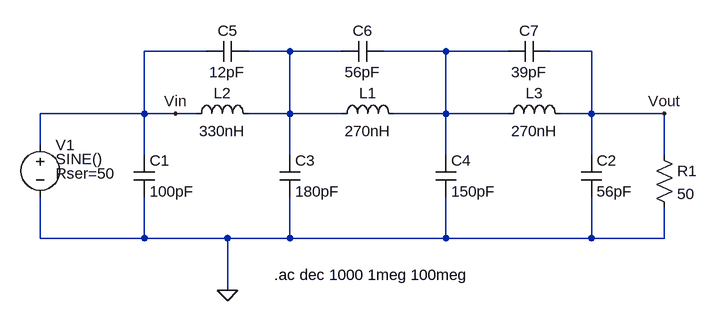
[diagram p0: schematic DXFT8Filter.asc]
DXFT8Filter.asc, the LTspice schematic file:
Version 4
SHEET 1 1492 680
WIRE 400 128 304 128
WIRE 528 128 464 128
WIRE 608 128 528 128
WIRE 768 128 672 128
WIRE 864 128 768 128
WIRE 992 128 928 128
WIRE 304 224 304 128
WIRE 304 224 144 224
WIRE 352 224 304 224
WIRE 384 224 352 224
WIRE 528 224 528 128
WIRE 528 224 464 224
WIRE 608 224 528 224
WIRE 768 224 768 128
WIRE 768 224 688 224
WIRE 864 224 768 224
WIRE 992 224 992 128
WIRE 992 224 944 224
WIRE 1104 224 992 224
WIRE 144 272 144 224
WIRE 304 288 304 224
WIRE 528 288 528 224
WIRE 768 288 768 224
WIRE 992 288 992 224
WIRE 1104 288 1104 224
WIRE 144 416 144 352
WIRE 304 416 304 352
WIRE 304 416 144 416
WIRE 432 416 304 416
WIRE 528 416 528 352
WIRE 528 416 432 416
WIRE 768 416 768 352
WIRE 768 416 528 416
WIRE 992 416 992 352
WIRE 992 416 768 416
WIRE 1104 416 1104 368
WIRE 1104 416 992 416
WIRE 432 496 432 416
FLAG 1104 224 Vout
FLAG 432 496 0
FLAG 352 224 Vin
SYMBOL voltage 144 256 R0
WINDOW 3 24 38 Left 2
WINDOW 39 24 60 Left 2
SYMATTR Value SINE()
SYMATTR SpiceLine Rser=50
SYMATTR InstName V1
SYMATTR Value2 AC 1
SYMBOL res 1088 272 R0
SYMATTR InstName R1
SYMATTR Value 50
SYMBOL cap 288 288 R0
SYMATTR InstName C1
SYMATTR Value 100pF
SYMBOL cap 976 288 R0
SYMATTR InstName C2
SYMATTR Value 56pF
SYMBOL ind 368 240 R270
WINDOW 0 32 56 VTop 2
WINDOW 3 5 56 VBottom 2
SYMATTR InstName L2
SYMATTR Value 330nH
SYMBOL Cap 512 288 R0
SYMATTR InstName C3
SYMATTR Value 180pF
SYMBOL Ind 592 240 R270
WINDOW 0 32 56 VTop 2
WINDOW 3 5 56 VBottom 2
SYMATTR InstName L1
SYMATTR Value 270nH
SYMBOL Ind 848 240 R270
WINDOW 0 32 56 VTop 2
WINDOW 3 5 56 VBottom 2
SYMATTR InstName L3
SYMATTR Value 270nH
SYMBOL Cap 752 288 R0
SYMATTR InstName C4
SYMATTR Value 150pF
SYMBOL Cap 464 112 R90
WINDOW 0 0 32 VBottom 2
WINDOW 3 32 32 VTop 2
SYMATTR InstName C5
SYMATTR Value 12pF
SYMBOL Cap 672 112 R90
WINDOW 0 0 32 VBottom 2
WINDOW 3 32 32 VTop 2
SYMATTR InstName C6
SYMATTR Value 56pF
SYMBOL Cap 928 112 R90
WINDOW 0 0 32 VBottom 2
WINDOW 3 32 32 VTop 2
SYMATTR InstName C7
SYMATTR Value 39pF
TEXT 504 472 Left 2 !.ac dec 1000 1meg 100meg

The netlist it stands for:
* DXFT8Filter.asc
V1 Vin 0 SINE() AC 1 Rser=50
R1 Vout 0 50
C1 Vin 0 100pF
C2 Vout 0 56pF
L2 Vin N001 330nH
C3 N001 0 180pF
L1 N001 N002 270nH
L3 N002 Vout 270nH
C4 N002 0 150pF
C5 N001 Vin 12pF
C6 N002 N001 56pF
C7 Vout N002 39pF
.ac dec 1000 1meg 100meg
.backanno
.end